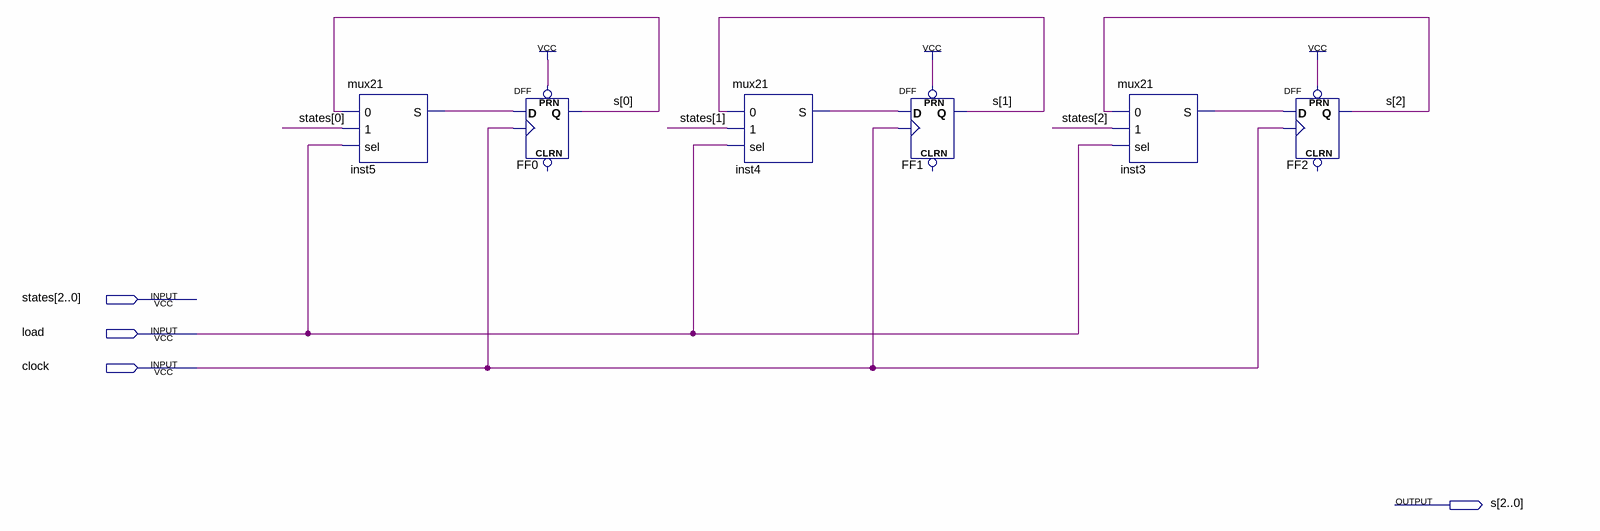
[diagram p0: schematic sheet]
// Quartus schematic reg3b.bdf as structural Verilog: 6 symbols, 4 pins
module reg3b (
  input  [2:0] states,
  input  load,
  input  clock,
  output [2:0] s
);

  wire inst3_s, inst4_s, inst5_s;

  mux21 inst5 (.\0 (s[0]), .\1 (states[0]), .sel(load), .S(inst5_s));
  DFF FF0 (.CLK(clock), .D(inst5_s), .PRN(1'b1), .Q(s[0]));  // open: CLRN
  mux21 inst4 (.\0 (s[1]), .\1 (states[1]), .sel(load), .S(inst4_s));
  DFF FF1 (.CLK(clock), .D(inst4_s), .PRN(1'b1), .Q(s[1]));  // open: CLRN
  mux21 inst3 (.\0 (s[2]), .\1 (states[2]), .sel(load), .S(inst3_s));
  DFF FF2 (.CLK(clock), .D(inst3_s), .PRN(1'b1), .Q(s[2]));  // open: CLRN
endmodule
